# Altium schematic sheet MCU.SchDoc
size 420 x 297 mm; SheetNumber: 2; SheetTotal: 13; ENG_APP_DATE: --/--/--; DSN_APP_DATE: --/--/--; CHK_APP_DATE: --/--/--
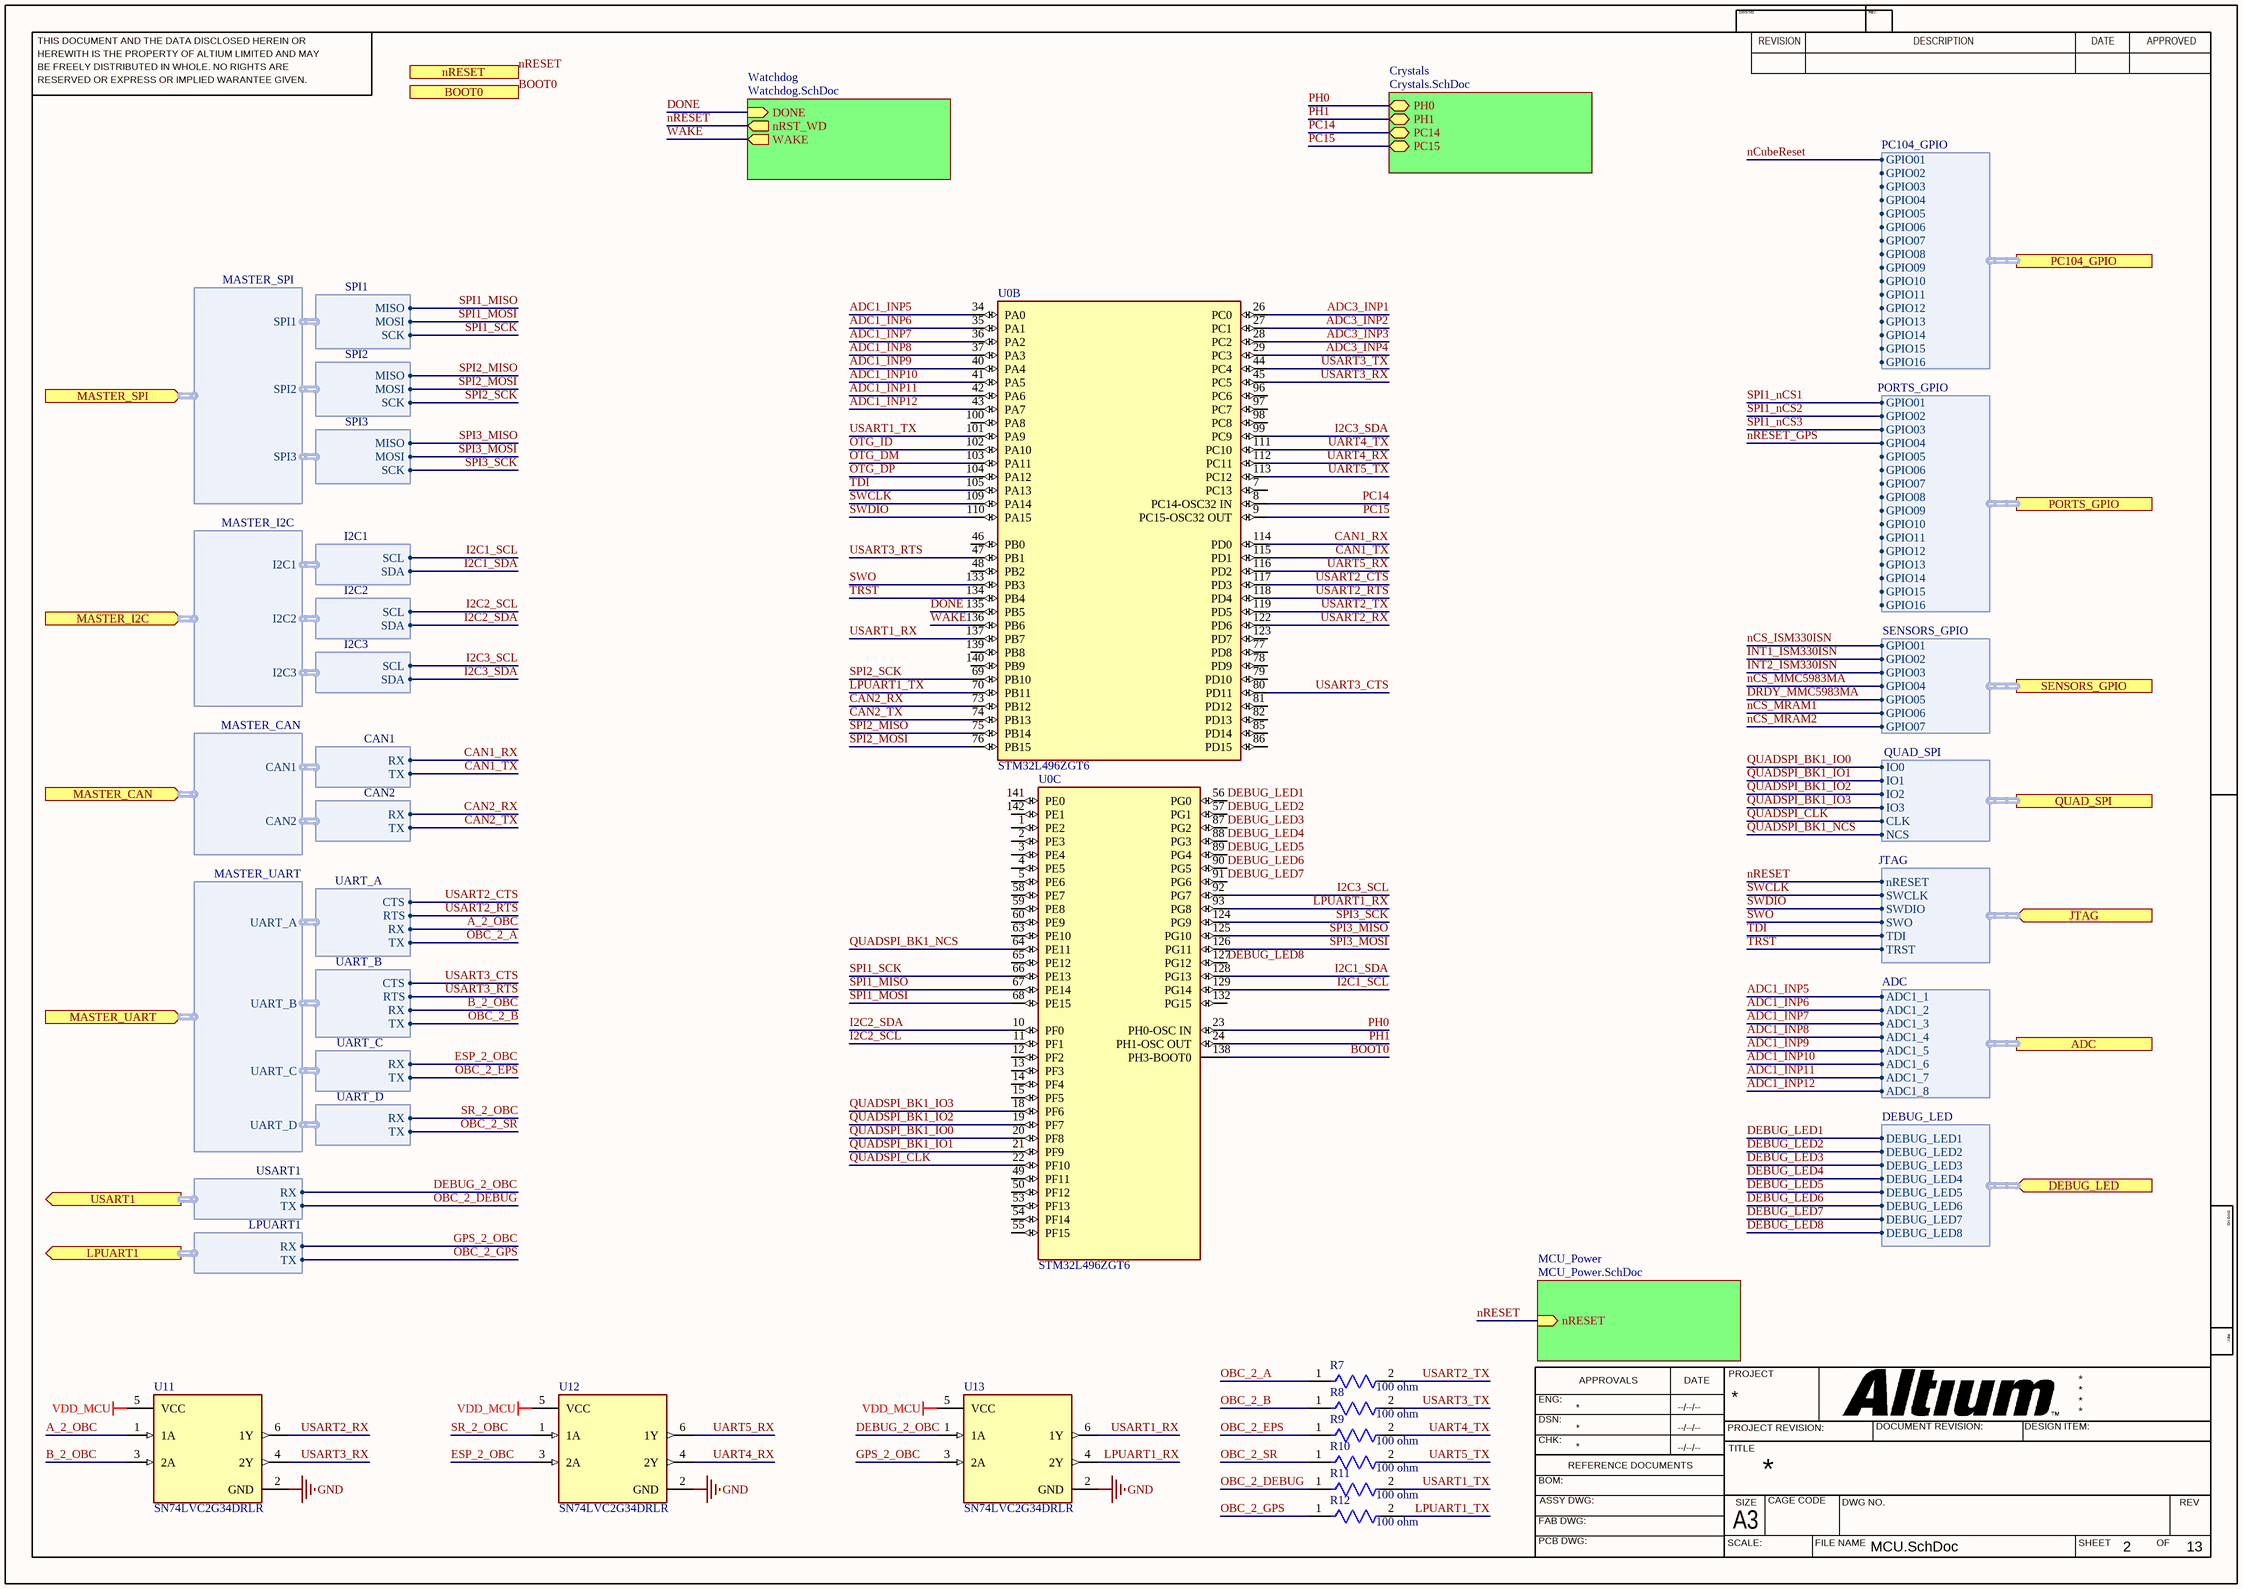
[diagram p0: MCU.SchDoc]

## Parts
R7  100 ohm  [FP-ERJP03-MFG]
R8  100 ohm  [FP-ERJP03-MFG]
R9  100 ohm  [FP-ERJP03-MFG]
R10  100 ohm  [FP-ERJP03-MFG]
R11  100 ohm  [FP-ERJP03-MFG]
R12  100 ohm  [FP-ERJP03-MFG]
U0  STM32L496ZGT6  [FP-LQFP144-1A-MFG]  (parts B,C of 3)
U11  SN74LVC2G34DRLR  [FP-DRL0006A-MFG]
U12  SN74LVC2G34DRLR  [FP-DRL0006A-MFG]
U13  SN74LVC2G34DRLR  [FP-DRL0006A-MFG]

## Sub-sheets
Crystals = Crystals.SchDoc: PC14 (bidir), PC15 (bidir), PH0 (bidir), PH1 (bidir)
MCU_Power = MCU_Power.SchDoc: nRESET (in)
Watchdog = Watchdog.SchDoc: nRST_WD (out), DONE (in), WAKE (out)

## Ports
ADC (harness ADC), BOOT0 (in), DEBUG_LED (in, harness DEBUG_LED), JTAG (in, harness JTAG), LPUART1 (out, harness LPUART1), MASTER_CAN (in, harness MASTER_CAN), MASTER_I2C (in, harness MASTER_I2C), MASTER_SPI (in, harness MASTER_SPI), MASTER_UART (in, harness MASTER_UART), nRESET (in), PC104_GPIO (harness PC104_GPIO), PORTS_GPIO (harness PORTS_GPIO), QUAD_SPI (harness QUAD_SPI), SENSORS_GPIO (harness SENSORS_GPIO), USART1 (out, harness USART1)

## Harnesses
MASTER_I2C: I2C1, I2C2, I2C3
MASTER_UART: UART_A, UART_B, UART_C, UART_D
I2C1: SDA, SCL
MASTER_SPI: SPI1, SPI2, SPI3
SPI1: MOSI, MISO, SCK
SPI2: MOSI, MISO, SCK
SPI3: MISO, SCK, MOSI
MASTER_CAN: CAN1, CAN2
CAN1: TX, RX
CAN2: TX, RX
ADC: ADC1_1, ADC1_2, ADC1_3, ADC1_4, ADC1_5, ADC1_6, ADC1_7, ADC1_8
JTAG: nRESET, SWCLK, SWDIO, SWO, TDI, TRST
I2C2: SDA, SCL
UART_A: TX, RX, RTS, CTS
UART_B: TX, RX, RTS, CTS
QUAD_SPI: IO0, IO1, CLK, NCS, IO2, IO3
I2C3: SDA, SCL
USART1: TX, RX
LPUART1: TX, RX
UART_D: TX, RX
UART_C: RX, TX
DEBUG_LED: DEBUG_LED1, DEBUG_LED2, DEBUG_LED3, DEBUG_LED4, DEBUG_LED5, DEBUG_LED6, DEBUG_LED7, DEBUG_LED8
SENSORS_GPIO: GPIO01, GPIO02, GPIO03, GPIO04, GPIO05, GPIO06, GPIO07
PORTS_GPIO: GPIO01, GPIO02, GPIO03, GPIO04, GPIO05, GPIO06, GPIO07, GPIO08, GPIO09, GPIO10, GPIO11, GPIO12, GPIO13, GPIO14, GPIO15, GPIO16
PC104_GPIO: GPIO01, GPIO02, GPIO03, GPIO04, GPIO05, GPIO06, GPIO07, GPIO08, GPIO09, GPIO10, GPIO11, GPIO12, GPIO13, GPIO14, GPIO15, GPIO16

## Nets
GND: U11.2(GND) U12.2(GND) U13.2(GND)
VDD_MCU: U11.5(VCC) U12.5(VCC) U13.5(VCC)
A_2_OBC: U11.1(1A) ; harness UART_A.RX
ADC1_INP5: U0.34(PA0) ; port ADC.ADC1_1
ADC1_INP6: U0.35(PA1) ; port ADC.ADC1_2
ADC1_INP7: U0.36(PA2) ; port ADC.ADC1_3
ADC1_INP8: U0.37(PA3) ; port ADC.ADC1_4
ADC1_INP9: U0.40(PA4) ; port ADC.ADC1_5
ADC1_INP10: U0.41(PA5) ; port ADC.ADC1_6
ADC1_INP11: U0.42(PA6) ; port ADC.ADC1_7
ADC1_INP12: U0.43(PA7) ; port ADC.ADC1_8
ADC3_INP1: U0.26(PC0)
ADC3_INP2: U0.27(PC1)
ADC3_INP3: U0.28(PC2)
ADC3_INP4: U0.29(PC3)
B_2_OBC: U11.3(2A) ; harness UART_B.RX
BOOT0: U0.138(PH3-BOOT0) ; port BOOT0
CAN1_RX: U0.114(PD0) ; harness CAN1.RX
CAN1_TX: U0.115(PD1) ; harness CAN1.TX
CAN2_RX: U0.73(PB12) ; harness CAN2.RX
CAN2_TX: U0.74(PB13) ; harness CAN2.TX
DEBUG_2_OBC: U13.1(1A) ; port USART1.RX
DEBUG_LED1: U0.56(PG0) ; port DEBUG_LED.DEBUG_LED1
DEBUG_LED2: U0.57(PG1) ; port DEBUG_LED.DEBUG_LED2
DEBUG_LED3: U0.87(PG2) ; port DEBUG_LED.DEBUG_LED3
DEBUG_LED4: U0.88(PG3) ; port DEBUG_LED.DEBUG_LED4
DEBUG_LED5: U0.89(PG4) ; port DEBUG_LED.DEBUG_LED5
DEBUG_LED6: U0.90(PG5) ; port DEBUG_LED.DEBUG_LED6
DEBUG_LED7: U0.91(PG6) ; port DEBUG_LED.DEBUG_LED7
DEBUG_LED8: U0.127(PG12) ; port DEBUG_LED.DEBUG_LED8
DONE: U0.135(PB5) ; sheet Watchdog/DONE
DRDY_MMC5983MA: port SENSORS_GPIO.GPIO05
ESP_2_OBC: U12.3(2A) ; harness UART_C.RX
GPS_2_OBC: U13.3(2A) ; port LPUART1.RX
I2C1_SCL: U0.129(PG14) ; harness I2C1.SCL
I2C1_SDA: U0.128(PG13) ; harness I2C1.SDA
I2C2_SCL: U0.11(PF1) ; harness I2C2.SCL
I2C2_SDA: U0.10(PF0) ; harness I2C2.SDA
I2C3_SCL: U0.92(PG7) ; harness I2C3.SCL
I2C3_SDA: U0.99(PC9) ; harness I2C3.SDA
INT1_ISM330ISN: port SENSORS_GPIO.GPIO02
INT2_ISM330ISN: port SENSORS_GPIO.GPIO03
LPUART1_RX: U0.93(PG8) U13.4(2Y)
LPUART1_TX: R12.2 U0.70(PB11)
nCS_ISM330ISN: port SENSORS_GPIO.GPIO01
nCS_MMC5983MA: port SENSORS_GPIO.GPIO04
nCS_MRAM1: port SENSORS_GPIO.GPIO06
nCS_MRAM2: port SENSORS_GPIO.GPIO07
nCubeReset: port PC104_GPIO.GPIO01
nRESET: port nRESET, sheet MCU_Power/nRESET, sheet Watchdog/nRST_WD, port JTAG.nRESET
nRESET_GPS: port PORTS_GPIO.GPIO04
OBC_2_A: R7.1 ; harness UART_A.TX
OBC_2_B: R8.1 ; harness UART_B.TX
OBC_2_DEBUG: R11.1 ; port USART1.TX
OBC_2_EPS: R9.1 ; harness UART_C.TX
OBC_2_GPS: R12.1 ; port LPUART1.TX
OBC_2_SR: R10.1 ; harness UART_D.TX
OTG_DM: U0.103(PA11)
OTG_DP: U0.104(PA12)
OTG_ID: U0.102(PA10)
PC14: U0.8(PC14-OSC32_IN) ; sheet Crystals/PC14
PC15: U0.9(PC15-OSC32_OUT) ; sheet Crystals/PC15
PH0: U0.23(PH0-OSC_IN) ; sheet Crystals/PH0
PH1: U0.24(PH1-OSC_OUT) ; sheet Crystals/PH1
QUADSPI_BK1_IO0: U0.20(PF8) ; port QUAD_SPI.IO0
QUADSPI_BK1_IO1: U0.21(PF9) ; port QUAD_SPI.IO1
QUADSPI_BK1_IO2: U0.19(PF7) ; port QUAD_SPI.IO2
QUADSPI_BK1_IO3: U0.18(PF6) ; port QUAD_SPI.IO3
QUADSPI_BK1_NCS: U0.64(PE11) ; port QUAD_SPI.NCS
QUADSPI_CLK: U0.22(PF10) ; port QUAD_SPI.CLK
SPI1_MISO: U0.67(PE14) ; harness SPI1.MISO
SPI1_MOSI: U0.68(PE15) ; harness SPI1.MOSI
SPI1_nCS1: port PORTS_GPIO.GPIO01
SPI1_nCS2: port PORTS_GPIO.GPIO02
SPI1_nCS3: port PORTS_GPIO.GPIO03
SPI1_SCK: U0.66(PE13) ; harness SPI1.SCK
SPI2_MISO: U0.75(PB14) ; harness SPI2.MISO
SPI2_MOSI: U0.76(PB15) ; harness SPI2.MOSI
SPI2_SCK: U0.69(PB10) ; harness SPI2.SCK
SPI3_MISO: U0.125(PG10) ; harness SPI3.MISO
SPI3_MOSI: U0.126(PG11) ; harness SPI3.MOSI
SPI3_SCK: U0.124(PG9) ; harness SPI3.SCK
SR_2_OBC: U12.1(1A) ; harness UART_D.RX
SWCLK: U0.109(PA14) ; port JTAG.SWCLK
SWDIO: U0.110(PA15) ; port JTAG.SWDIO
SWO: U0.133(PB3) ; port JTAG.SWO
TDI: U0.105(PA13) ; port JTAG.TDI
TRST: U0.134(PB4) ; port JTAG.TRST
UART4_RX: U0.112(PC11) U12.4(2Y)
UART4_TX: R9.2 U0.111(PC10)
UART5_RX: U0.116(PD2) U12.6(1Y)
UART5_TX: R10.2 U0.113(PC12)
USART1_RX: U0.137(PB7) U13.6(1Y)
USART1_TX: R11.2 U0.101(PA9)
USART2_CTS: U0.117(PD3) ; harness UART_A.CTS
USART2_RTS: U0.118(PD4) ; harness UART_A.RTS
USART2_RX: U0.122(PD6) U11.6(1Y)
USART2_TX: R7.2 U0.119(PD5)
USART3_CTS: U0.80(PD11) ; harness UART_B.CTS
USART3_RTS: U0.47(PB1) ; harness UART_B.RTS
USART3_RX: U0.45(PC5) U11.4(2Y)
USART3_TX: R8.2 U0.44(PC4)
WAKE: U0.136(PB6) ; sheet Watchdog/WAKE

Not connected (* = marked no-connect by the designer): U0 1(PE2) 2(PE3) 3(PE4) 4(PE5) 5(PE6) 7(PC13) 12(PF2) 13(PF3) 14(PF4) 15(PF5) 46(PB0) 48(PB2) 49(PF11) 50(PF12) 53(PF13) 54(PF14) 55(PF15) 58(PE7) 59(PE8) 60(PE9) 63(PE10) 65(PE12) 77(PD8) 78(PD9) 79(PD10) 81(PD12) 82(PD13) 85(PD14) 86(PD15) 96(PC6) 97(PC7) 98(PC8) 100(PA8) 123(PD7) 132(PG15) 139(PB8) 140(PB9) 141(PE0) 142(PE1)

## Notes on the sheet
- THIS DOCUMENT AND THE DATA DISCLOSED HEREIN OR
- HEREWITH IS THE PROPERTY OF ALTIUM LIMITED AND MAY
- DWG NO:
- REVISION
- REV:
- DESCRIPTION
- DATE
- APPROVED
- BE FREELY DISTRIBUTED IN WHOLE. NO RIGHTS ARE
- RESERVED OR EXPRESS OR IMPLIED WARANTEE GIVEN.
- ENG:
- APPROVALS
- PROJECT
- DSN:
- CHK:
- REFERENCE DOCUMENTS
- PROJECT REVISION:
- TITLE
- DOCUMENT REVISION:
- DESIGN ITEM:
- BOM:
- FAB DWG:
- PCB DWG:
- ASSY DWG:
- SCALE:
- A3
- SIZE
- CAGE CODE
- FILE NAME
- DWG NO.
- SHEET
- OF
- REV

## Library data of the parts
R7-R12 = CMP-00287-21317759-1: ERJ-P03F1000V SMD Chip Resistor, 100 Ohm, ± 1%, 200 mW, 0603 [1608 Metric], Thick Film, Anti-Surge; Temperature Coefficient: 200ppm/°C; Resistance: 100Ω; Voltage Rating (DC): 150V; Power Rating: 200mW; Tolerance: 1%; Termination: Tab; RoHS: Compliant; Composition: Thick Film; Min Operating Temperature: -55°C; Contact Plating: Tin; Case Code (Metric): 1608; Case/Package: 0603; Radiation Hardening: No; Mount: Surface Mount; Voltage Rating: 150V; Packaging: Cut Tape; Length: 1.6mm; REACH SVHC: No SVHC; Max Operating Temperature: 155°C; Depth: 800µm; Number of Pins: 2; Lifecycle Status: Production; Schedule B: 8533210045, 8533210045; Military Standard: Not; Height: 550µm; NexarPartId: 21317759; Case Code (Imperial): 0603
U0 = CMP-12105-000038-2: IC MCU 32BIT 1MB FLASH 144LQFP; Manufacturer Package Identifier: LQFP144-1A; NexarPartId: 80927210; Number of Channels: 24; Number of I2C Channels: 4; Frequency: 80MHz; Number of USB Channels: 1; Nominal Supply Current: 30nA; Data Bus Width: 32b; Number of Timers/Counters: 2; Number of USART Channels: 3; Max Junction Temperature (Tj): 105°C; Number of I/Os: 115; Number of PWM Channels: 28; Interface: CAN, I2C, I2S, IrDA, LIN, SPI, UART, USART, USB; Core Architecture: ARM Cortex-M4; RAM Size: 320kB; Min Supply Voltage: 1.05V; Max Supply Voltage: 3.6V; Min Operating Temperature: -40°C; RoHS: Non-Compliant; Memory Size: 1MB; Number of A/D Converters: 3; Number of SPI Channels: 3; Max Operating Temperature: 85°C; Memory Type: FLASH; Height: 1.6mm; Ambient Temperature Range High: 85°C; Schedule B: 8542310000, 8542310000; Number of D/A Converters: 2; Number of UART Channels: 2; Lifecycle Status: Production; Flash Memory Size: 1MB; Number of ADC Channels: 24
U11-U13 = CMP-0859-00812-4: IC BUFFER NON-INVERT 5.5V 6SOT; Number of Bits per Element: 1; Number of Bits: 2; Low Level Output Current: 32mA; Polarity: Non-Inverting; Min Supply Voltage: 1.65V; Propagation Delay: 8.6ns; High Level Output Current: -32mA; Quiescent Current: 10uA; Contact Plating: Gold; Case/Package: SOT; Technology: CMOS; Min Operating Temperature: -40°C; Number of Elements: 2; REACH SVHC: No SVHC; Number of Channels: 2; Series: 74LVC; Number of Pins: 6; Mount: Surface Mount; Logic Function: Buffer; Number of Output Lines: 2; Packaging: Tape and Reel; Package Quantity: 4000; Radiation Hardening: No; Number of Gates: 2; Turn-On Delay Time: 8.6ns; Max Operating Temperature: 125°C; Max Supply Voltage: 5.5V; Lead Free: Lead Free; RoHS Compliant: Yes; Number of Outputs: 2; Number of Inputs: 2; Number of Input Lines: 2